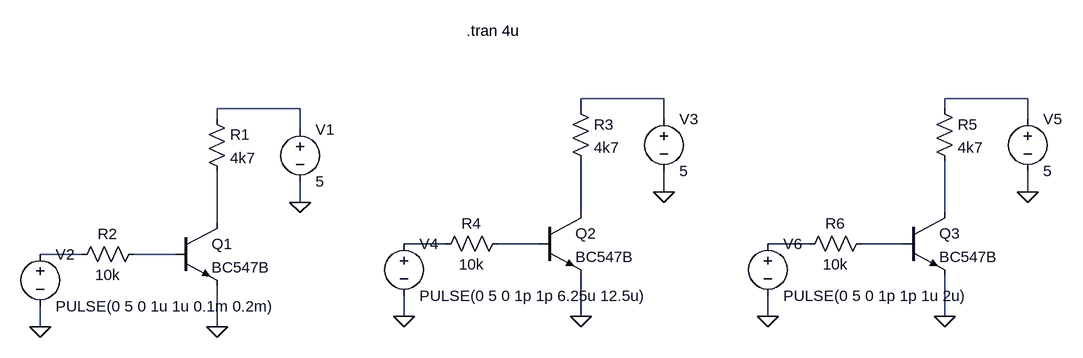
[diagram p0: schematic Draft1.asc]
Draft1.asc, the LTspice schematic file:
Version 4
SHEET 1 1464 680
WIRE 848 -144 720 -144
WIRE 1408 -144 1280 -144
WIRE 288 -128 160 -128
WIRE 720 -128 720 -144
WIRE 1280 -128 1280 -144
WIRE 160 -112 160 -128
WIRE 848 -112 848 -144
WIRE 1408 -112 1408 -144
WIRE 288 -96 288 -128
WIRE 848 0 848 -32
WIRE 1408 0 1408 -32
WIRE 288 16 288 -16
WIRE 720 32 720 -48
WIRE 1280 32 1280 -48
WIRE 160 48 160 -32
WIRE 512 80 448 80
WIRE 656 80 592 80
WIRE 1072 80 1008 80
WIRE 1216 80 1152 80
WIRE -48 96 -112 96
WIRE 96 96 32 96
WIRE 448 192 448 160
WIRE 720 192 720 128
WIRE 1008 192 1008 160
WIRE 1280 192 1280 128
WIRE -112 208 -112 176
WIRE 160 208 160 144
FLAG 160 208 0
FLAG 288 16 0
FLAG -112 208 0
FLAG 720 192 0
FLAG 848 0 0
FLAG 448 192 0
FLAG 1280 192 0
FLAG 1408 0 0
FLAG 1008 192 0
SYMBOL npn 96 48 R0
SYMATTR InstName Q1
SYMATTR Value BC547B
SYMBOL res 144 -128 R0
SYMATTR InstName R1
SYMATTR Value 4k7
SYMBOL res 48 80 R90
WINDOW 0 0 56 VBottom 2
WINDOW 3 32 56 VTop 2
SYMATTR InstName R2
SYMATTR Value 10k
SYMBOL voltage 288 -112 R0
WINDOW 123 0 0 Left 0
WINDOW 39 0 0 Left 0
SYMATTR InstName V1
SYMATTR Value 5
SYMBOL voltage -112 80 R0
WINDOW 123 0 0 Left 0
WINDOW 39 0 0 Left 0
SYMATTR InstName V2
SYMATTR Value PULSE(0 5 0 1u 1u 0.1m 0.2m)
SYMBOL npn 656 32 R0
SYMATTR InstName Q2
SYMATTR Value BC547B
SYMBOL res 704 -144 R0
SYMATTR InstName R3
SYMATTR Value 4k7
SYMBOL res 608 64 R90
WINDOW 0 0 56 VBottom 2
WINDOW 3 32 56 VTop 2
SYMATTR InstName R4
SYMATTR Value 10k
SYMBOL voltage 848 -128 R0
WINDOW 123 0 0 Left 0
WINDOW 39 0 0 Left 0
SYMATTR InstName V3
SYMATTR Value 5
SYMBOL voltage 448 64 R0
WINDOW 123 0 0 Left 0
WINDOW 39 0 0 Left 0
SYMATTR InstName V4
SYMATTR Value PULSE(0 5 0 1p 1p 6.25u 12.5u)
SYMBOL npn 1216 32 R0
SYMATTR InstName Q3
SYMATTR Value BC547B
SYMBOL res 1264 -144 R0
SYMATTR InstName R5
SYMATTR Value 4k7
SYMBOL res 1168 64 R90
WINDOW 0 0 56 VBottom 2
WINDOW 3 32 56 VTop 2
SYMATTR InstName R6
SYMATTR Value 10k
SYMBOL voltage 1408 -128 R0
WINDOW 123 0 0 Left 0
WINDOW 39 0 0 Left 0
SYMATTR InstName V5
SYMATTR Value 5
SYMBOL voltage 1008 64 R0
WINDOW 123 0 0 Left 0
WINDOW 39 0 0 Left 0
SYMATTR InstName V6
SYMATTR Value PULSE(0 5 0 1p 1p 1u 2u)
TEXT 544 -248 Left 2 !.tran 4u

The netlist it stands for:
* Draft1.asc
Q1 N006 N012 0 0 BC547B
R1 N003 N006 4k7
R2 N012 N011 10k
V1 N003 0 5
V2 N011 0 PULSE(0 5 0 1u 1u 0.1m 0.2m)
Q2 N004 N008 0 0 BC547B
R3 N001 N004 4k7
R4 N008 N007 10k
V3 N001 0 5
V4 N007 0 PULSE(0 5 0 1p 1p 6.25u 12.5u)
Q3 N005 N010 0 0 BC547B
R5 N002 N005 4k7
R6 N010 N009 10k
V5 N002 0 5
V6 N009 0 PULSE(0 5 0 1p 1p 1u 2u)
.model NPN NPN
.model PNP PNP
.lib standard.bjt
.tran 4u
.backanno
.end